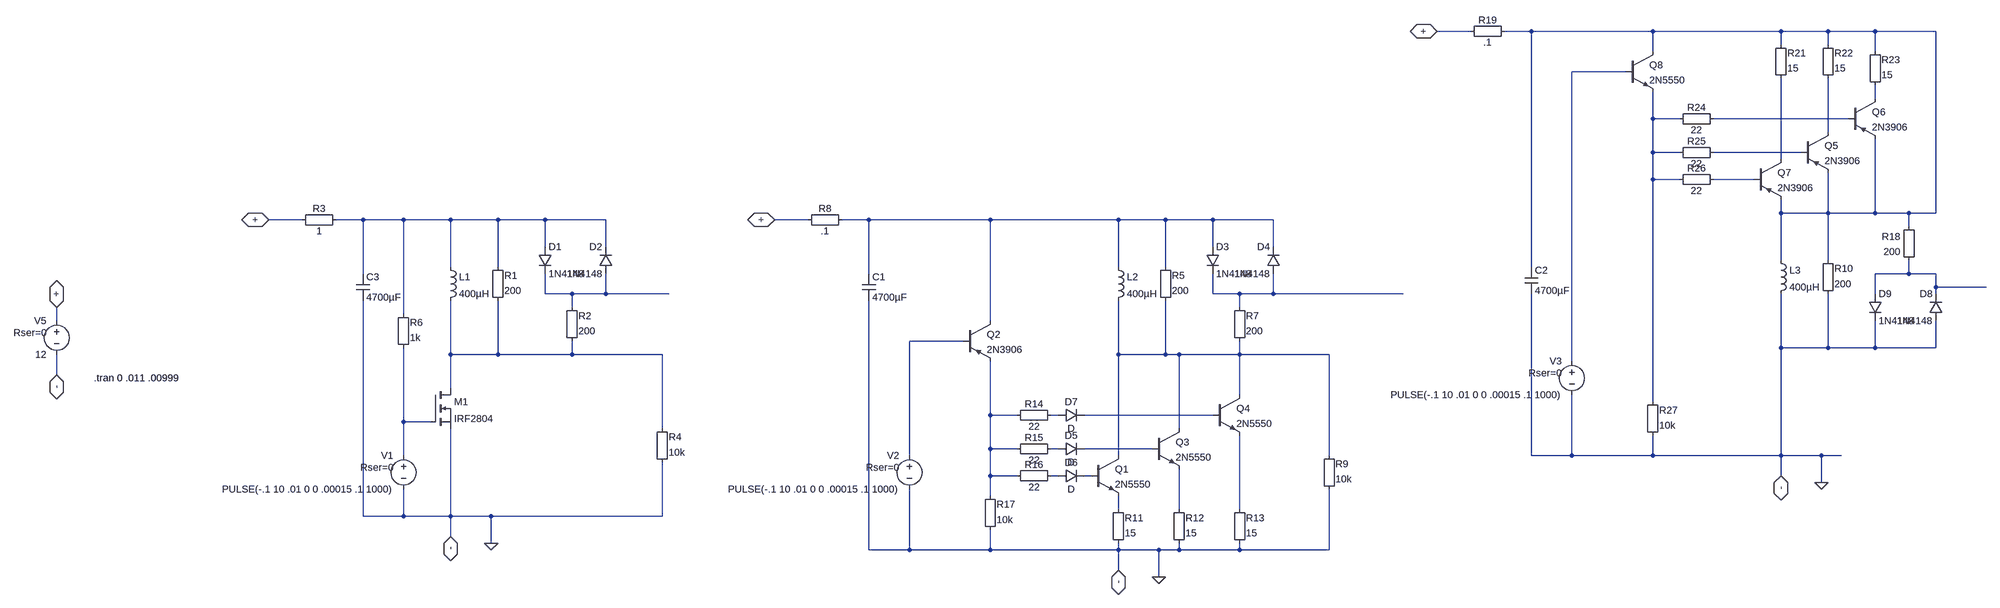
[diagram p0: schematic meat_haw_4.asc]
meat_haw_4.asc, the LTspice schematic file:
Version 4
SHEET 1 4676 1612
WIRE 2896 -2912 2816 -2912
WIRE 3040 -2912 2976 -2912
WIRE 3328 -2912 3040 -2912
WIRE 3632 -2912 3328 -2912
WIRE 3744 -2912 3632 -2912
WIRE 3856 -2912 3744 -2912
WIRE 4000 -2912 3856 -2912
WIRE 3632 -2880 3632 -2912
WIRE 3744 -2880 3744 -2912
WIRE 3328 -2864 3328 -2912
WIRE 3856 -2864 3856 -2912
WIRE 3264 -2816 3136 -2816
WIRE 3856 -2752 3856 -2784
WIRE 3328 -2704 3328 -2768
WIRE 3392 -2704 3328 -2704
WIRE 3792 -2704 3472 -2704
WIRE 3744 -2672 3744 -2800
WIRE 3328 -2624 3328 -2704
WIRE 3392 -2624 3328 -2624
WIRE 3680 -2624 3472 -2624
WIRE 3632 -2608 3632 -2800
WIRE 3328 -2560 3328 -2624
WIRE 3392 -2560 3328 -2560
WIRE 3568 -2560 3472 -2560
WIRE 3632 -2480 3632 -2512
WIRE 3744 -2480 3744 -2576
WIRE 3744 -2480 3632 -2480
WIRE 3856 -2480 3856 -2656
WIRE 3856 -2480 3744 -2480
WIRE 3936 -2480 3856 -2480
WIRE 4000 -2480 4000 -2912
WIRE 4000 -2480 3936 -2480
WIRE -112 -2464 -192 -2464
WIRE 32 -2464 -32 -2464
WIRE 128 -2464 32 -2464
WIRE 240 -2464 128 -2464
WIRE 352 -2464 240 -2464
WIRE 464 -2464 352 -2464
WIRE 608 -2464 464 -2464
WIRE 1312 -2464 1232 -2464
WIRE 1456 -2464 1392 -2464
WIRE 1744 -2464 1456 -2464
WIRE 2048 -2464 1744 -2464
WIRE 2160 -2464 2048 -2464
WIRE 2272 -2464 2160 -2464
WIRE 2416 -2464 2272 -2464
WIRE 3936 -2448 3936 -2480
WIRE 464 -2400 464 -2464
WIRE 608 -2400 608 -2464
WIRE 2272 -2400 2272 -2464
WIRE 2416 -2400 2416 -2464
WIRE 3632 -2368 3632 -2480
WIRE 3744 -2368 3744 -2480
WIRE 240 -2352 240 -2464
WIRE 352 -2352 352 -2464
WIRE 2048 -2352 2048 -2464
WIRE 2160 -2352 2160 -2464
WIRE 3040 -2352 3040 -2912
WIRE 32 -2336 32 -2464
WIRE 1456 -2336 1456 -2464
WIRE 3936 -2336 3936 -2368
WIRE 3936 -2336 3856 -2336
WIRE 4000 -2336 3936 -2336
WIRE 4000 -2304 4000 -2336
WIRE 4320 -2304 4000 -2304
WIRE 464 -2288 464 -2336
WIRE 528 -2288 464 -2288
WIRE 608 -2288 608 -2336
WIRE 608 -2288 528 -2288
WIRE 768 -2288 608 -2288
WIRE 2272 -2288 2272 -2336
WIRE 2336 -2288 2272 -2288
WIRE 2416 -2288 2416 -2336
WIRE 2416 -2288 2336 -2288
WIRE 2736 -2288 2416 -2288
WIRE 3856 -2288 3856 -2336
WIRE 4000 -2288 4000 -2304
WIRE 528 -2256 528 -2288
WIRE 2336 -2256 2336 -2288
WIRE 128 -2240 128 -2464
WIRE -720 -2224 -720 -2256
WIRE 1744 -2224 1744 -2464
WIRE 1680 -2176 1552 -2176
WIRE 3632 -2160 3632 -2288
WIRE 3744 -2160 3744 -2288
WIRE 3744 -2160 3632 -2160
WIRE 3856 -2160 3856 -2224
WIRE 3856 -2160 3744 -2160
WIRE 4000 -2160 4000 -2224
WIRE 4000 -2160 3856 -2160
WIRE 240 -2144 240 -2272
WIRE 352 -2144 352 -2272
WIRE 352 -2144 240 -2144
WIRE 528 -2144 528 -2176
WIRE 528 -2144 352 -2144
WIRE 752 -2144 528 -2144
WIRE 2048 -2144 2048 -2272
WIRE 2160 -2144 2160 -2272
WIRE 2160 -2144 2048 -2144
WIRE 2192 -2144 2160 -2144
WIRE 2336 -2144 2336 -2176
WIRE 2336 -2144 2192 -2144
WIRE 2560 -2144 2336 -2144
WIRE 3136 -2128 3136 -2816
WIRE -720 -2096 -720 -2144
WIRE 240 -2064 240 -2144
WIRE 2336 -2048 2336 -2144
WIRE 3328 -2032 3328 -2560
WIRE 1744 -2000 1744 -2128
WIRE 1808 -2000 1744 -2000
WIRE 1904 -2000 1888 -2000
WIRE 2272 -2000 1968 -2000
WIRE 128 -1984 128 -2160
WIRE 192 -1984 128 -1984
WIRE 752 -1968 752 -2144
WIRE 2192 -1968 2192 -2144
WIRE 1744 -1920 1744 -2000
WIRE 1808 -1920 1744 -1920
WIRE 1904 -1920 1888 -1920
WIRE 2128 -1920 1968 -1920
WIRE 128 -1904 128 -1984
WIRE 1552 -1904 1552 -2176
WIRE 2048 -1904 2048 -2144
WIRE 2560 -1904 2560 -2144
WIRE 3040 -1904 3040 -2288
WIRE 3136 -1904 3136 -2048
WIRE 3136 -1904 3040 -1904
WIRE 3328 -1904 3328 -1952
WIRE 3328 -1904 3136 -1904
WIRE 3632 -1904 3632 -2160
WIRE 3632 -1904 3328 -1904
WIRE 3728 -1904 3632 -1904
WIRE 3776 -1904 3728 -1904
WIRE 1744 -1856 1744 -1920
WIRE 1808 -1856 1744 -1856
WIRE 1904 -1856 1888 -1856
WIRE 1984 -1856 1968 -1856
WIRE 3632 -1856 3632 -1904
WIRE 3728 -1840 3728 -1904
WIRE 1744 -1808 1744 -1856
WIRE 2048 -1776 2048 -1808
WIRE 2192 -1776 2192 -1872
WIRE 2336 -1776 2336 -1952
WIRE 32 -1760 32 -2272
WIRE 128 -1760 128 -1824
WIRE 128 -1760 32 -1760
WIRE 240 -1760 240 -1968
WIRE 240 -1760 128 -1760
WIRE 336 -1760 240 -1760
WIRE 752 -1760 752 -1888
WIRE 752 -1760 336 -1760
WIRE 240 -1712 240 -1760
WIRE 336 -1696 336 -1760
WIRE 1456 -1680 1456 -2272
WIRE 1552 -1680 1552 -1824
WIRE 1552 -1680 1456 -1680
WIRE 1744 -1680 1744 -1728
WIRE 1744 -1680 1552 -1680
WIRE 2048 -1680 2048 -1696
WIRE 2048 -1680 1744 -1680
WIRE 2144 -1680 2048 -1680
WIRE 2192 -1680 2192 -1696
WIRE 2192 -1680 2144 -1680
WIRE 2336 -1680 2336 -1696
WIRE 2336 -1680 2192 -1680
WIRE 2560 -1680 2560 -1824
WIRE 2560 -1680 2336 -1680
WIRE 2048 -1632 2048 -1680
WIRE 2144 -1616 2144 -1680
FLAG -720 -2256 +
IOPIN -720 -2256 BiDir
FLAG -720 -2096 -
IOPIN -720 -2096 BiDir
FLAG 240 -1712 -
IOPIN 240 -1712 BiDir
FLAG -192 -2464 +
IOPIN -192 -2464 BiDir
FLAG 336 -1696 0
FLAG 2048 -1632 -
IOPIN 2048 -1632 BiDir
FLAG 1232 -2464 +
IOPIN 1232 -2464 BiDir
FLAG 2144 -1616 0
FLAG 3632 -1856 -
IOPIN 3632 -1856 BiDir
FLAG 2816 -2912 +
IOPIN 2816 -2912 BiDir
FLAG 3728 -1840 0
SYMBOL voltage -720 -2240 M0
WINDOW 123 0 0 Left 2
WINDOW 39 24 44 Left 2
SYMATTR SpiceLine Rser=0
SYMATTR InstName V5
SYMATTR Value 12
SYMBOL Misc\\EuropeanCap 16 -2336 R0
SYMATTR InstName C3
SYMATTR Value 4700µF
SYMATTR SpiceLine V=400 Irms=1 Rser=.32 Lser=0
SYMBOL ind 224 -2368 R0
SYMATTR InstName L1
SYMATTR Value 400µH
SYMBOL Misc\\EuropeanResistor 336 -2256 M180
WINDOW 0 31 76 Left 2
WINDOW 3 31 40 Left 2
SYMATTR InstName R1
SYMATTR Value 200
SYMBOL Misc\\EuropeanResistor 512 -2160 M180
WINDOW 0 31 76 Left 2
WINDOW 3 31 40 Left 2
SYMATTR InstName R2
SYMATTR Value 200
SYMBOL diode 448 -2400 R0
SYMATTR InstName D1
SYMATTR Value 1N4148
SYMBOL diode 624 -2336 R180
WINDOW 0 24 64 Left 2
WINDOW 3 24 0 Left 2
SYMATTR InstName D2
SYMATTR Value 1N4148
SYMBOL Misc\\EuropeanResistor -128 -2480 M90
WINDOW 0 5 56 VBottom 2
WINDOW 3 27 56 VTop 2
SYMATTR InstName R3
SYMATTR Value 1
SYMBOL nmos 192 -2064 R0
SYMATTR InstName M1
SYMATTR Value IRF2804
SYMBOL voltage 128 -1920 M0
WINDOW 123 0 0 Left 2
WINDOW 39 24 44 Left 2
SYMATTR SpiceLine Rser=0
SYMATTR InstName V1
SYMATTR Value PULSE(-.1 10 .01 0 0 .00015 .1 1000)
SYMBOL Misc\\EuropeanResistor 736 -1872 M180
WINDOW 0 31 76 Left 2
WINDOW 3 31 40 Left 2
SYMATTR InstName R4
SYMATTR Value 10k
SYMBOL Misc\\EuropeanResistor 112 -2144 M180
WINDOW 0 31 76 Left 2
WINDOW 3 31 40 Left 2
SYMATTR InstName R6
SYMATTR Value 1k
SYMBOL Misc\\EuropeanCap 1440 -2336 R0
SYMATTR InstName C1
SYMATTR Value 4700µF
SYMATTR SpiceLine V=400 Irms=1 Rser=.32 Lser=0
SYMBOL ind 2032 -2368 R0
SYMATTR InstName L2
SYMATTR Value 400µH
SYMATTR SpiceLine Rser=1
SYMBOL Misc\\EuropeanResistor 2144 -2256 M180
WINDOW 0 31 76 Left 2
WINDOW 3 31 40 Left 2
SYMATTR InstName R5
SYMATTR Value 200
SYMBOL Misc\\EuropeanResistor 2320 -2160 M180
WINDOW 0 31 76 Left 2
WINDOW 3 31 40 Left 2
SYMATTR InstName R7
SYMATTR Value 200
SYMBOL diode 2256 -2400 R0
SYMATTR InstName D3
SYMATTR Value 1N4148
SYMBOL diode 2432 -2336 R180
WINDOW 0 24 64 Left 2
WINDOW 3 24 0 Left 2
SYMATTR InstName D4
SYMATTR Value 1N4148
SYMBOL Misc\\EuropeanResistor 1296 -2480 M90
WINDOW 0 5 56 VBottom 2
WINDOW 3 27 56 VTop 2
SYMATTR InstName R8
SYMATTR Value .1
SYMBOL voltage 1552 -1920 M0
WINDOW 123 0 0 Left 2
WINDOW 39 24 44 Left 2
SYMATTR SpiceLine Rser=0
SYMATTR InstName V2
SYMATTR Value PULSE(-.1 10 .01 0 0 .00015 .1 1000)
SYMBOL Misc\\EuropeanResistor 2544 -1808 M180
WINDOW 0 31 76 Left 2
WINDOW 3 31 40 Left 2
SYMATTR InstName R9
SYMATTR Value 10k
SYMBOL npn3 1984 -1904 R0
SYMATTR InstName Q1
SYMATTR Value 2N5550
SYMBOL Misc\\EuropeanResistor 2032 -1680 M180
WINDOW 0 31 76 Left 2
WINDOW 3 31 40 Left 2
SYMATTR InstName R11
SYMATTR Value 15
SYMBOL pnp2 1680 -2224 R0
SYMATTR InstName Q2
SYMATTR Value 2N3906
SYMBOL npn3 2128 -1968 R0
SYMATTR InstName Q3
SYMATTR Value 2N5550
SYMBOL Misc\\EuropeanResistor 2176 -1680 M180
WINDOW 0 31 76 Left 2
WINDOW 3 31 40 Left 2
SYMATTR InstName R12
SYMATTR Value 15
SYMBOL npn3 2272 -2048 R0
SYMATTR InstName Q4
SYMATTR Value 2N5550
SYMBOL Misc\\EuropeanResistor 2320 -1680 M180
WINDOW 0 31 76 Left 2
WINDOW 3 31 40 Left 2
SYMATTR InstName R13
SYMATTR Value 15
SYMBOL Misc\\EuropeanResistor 1792 -2016 M90
WINDOW 0 5 56 VBottom 2
WINDOW 3 27 56 VTop 2
SYMATTR InstName R14
SYMATTR Value 22
SYMBOL Misc\\EuropeanResistor 1792 -1936 M90
WINDOW 0 5 56 VBottom 2
WINDOW 3 27 56 VTop 2
SYMATTR InstName R15
SYMATTR Value 22
SYMBOL Misc\\EuropeanResistor 1792 -1872 M90
WINDOW 0 5 56 VBottom 2
WINDOW 3 27 56 VTop 2
SYMATTR InstName R16
SYMATTR Value 22
SYMBOL Misc\\EuropeanResistor 1728 -1712 M180
WINDOW 0 31 76 Left 2
WINDOW 3 31 40 Left 2
SYMATTR InstName R17
SYMATTR Value 10k
SYMBOL diode 1904 -2016 M90
WINDOW 0 0 32 VBottom 2
WINDOW 3 32 32 VTop 2
SYMATTR InstName D7
SYMBOL diode 1904 -1936 M90
WINDOW 0 0 32 VBottom 2
WINDOW 3 32 32 VTop 2
SYMATTR InstName D5
SYMBOL diode 1904 -1872 M90
WINDOW 0 0 32 VBottom 2
WINDOW 3 32 32 VTop 2
SYMATTR InstName D6
SYMBOL Misc\\EuropeanCap 3024 -2352 R0
SYMATTR InstName C2
SYMATTR Value 4700µF
SYMATTR SpiceLine V=400 Irms=1 Rser=.32 Lser=0
SYMBOL ind 3616 -2384 R0
SYMATTR InstName L3
SYMATTR Value 400µH
SYMATTR SpiceLine Rser=1
SYMBOL Misc\\EuropeanResistor 3728 -2272 M180
WINDOW 0 31 76 Left 2
WINDOW 3 31 40 Left 2
SYMATTR InstName R10
SYMATTR Value 200
SYMBOL Misc\\EuropeanResistor 3952 -2464 M0
SYMATTR InstName R18
SYMATTR Value 200
SYMBOL diode 4016 -2224 R180
WINDOW 0 24 64 Left 2
WINDOW 3 24 0 Left 2
SYMATTR InstName D8
SYMATTR Value 1N4148
SYMBOL diode 3840 -2288 R0
SYMATTR InstName D9
SYMATTR Value 1N4148
SYMBOL Misc\\EuropeanResistor 2880 -2928 M90
WINDOW 0 5 56 VBottom 2
WINDOW 3 27 56 VTop 2
SYMATTR InstName R19
SYMATTR Value .1
SYMBOL voltage 3136 -2144 M0
WINDOW 123 0 0 Left 2
WINDOW 39 24 44 Left 2
SYMATTR SpiceLine Rser=0
SYMATTR InstName V3
SYMATTR Value PULSE(-.1 10 .01 0 0 .00015 .1 1000)
SYMBOL Misc\\EuropeanResistor 3616 -2784 M180
WINDOW 0 31 76 Left 2
WINDOW 3 31 40 Left 2
SYMATTR InstName R21
SYMATTR Value 15
SYMBOL pnp2 3792 -2752 R0
SYMATTR InstName Q6
SYMATTR Value 2N3906
SYMBOL Misc\\EuropeanResistor 3728 -2784 M180
WINDOW 0 31 76 Left 2
WINDOW 3 31 40 Left 2
SYMATTR InstName R22
SYMATTR Value 15
SYMBOL npn3 3264 -2864 R0
SYMATTR InstName Q8
SYMATTR Value 2N5550
SYMBOL Misc\\EuropeanResistor 3840 -2768 M180
WINDOW 0 31 76 Left 2
WINDOW 3 31 40 Left 2
SYMATTR InstName R23
SYMATTR Value 15
SYMBOL Misc\\EuropeanResistor 3376 -2720 M90
WINDOW 0 5 56 VBottom 2
WINDOW 3 27 56 VTop 2
SYMATTR InstName R24
SYMATTR Value 22
SYMBOL Misc\\EuropeanResistor 3376 -2640 M90
WINDOW 0 5 56 VBottom 2
WINDOW 3 27 56 VTop 2
SYMATTR InstName R25
SYMATTR Value 22
SYMBOL Misc\\EuropeanResistor 3376 -2576 M90
WINDOW 0 5 56 VBottom 2
WINDOW 3 27 56 VTop 2
SYMATTR InstName R26
SYMATTR Value 22
SYMBOL Misc\\EuropeanResistor 3312 -1936 M180
WINDOW 0 31 76 Left 2
WINDOW 3 31 40 Left 2
SYMATTR InstName R27
SYMATTR Value 10k
SYMBOL pnp2 3680 -2672 R0
SYMATTR InstName Q5
SYMATTR Value 2N3906
SYMBOL pnp2 3568 -2608 R0
SYMATTR InstName Q7
SYMATTR Value 2N3906
TEXT -632 -2088 Left 2 !.tran 0 .011 .00999

The netlist it stands for:
* meat_haw_4.asc
V5 + 0 12 Rser=0
C3 N010 0 4700µF V=400 Irms=1 Rser=.32 Lser=0
L1 N010 N016 400µH
R1 N016 N010 200
R2 N016 N013 200
D1 N010 N013 1N4148
D2 N013 N010 1N4148
R3 + N010 1
M1 N016 N021 0 0 IRF2804
V1 N021 0 PULSE(-.1 10 .01 0 0 .00015 .1 1000) Rser=0
R4 0 N016 10k
R6 N021 N010 1k
C1 N011 0 4700µF V=400 Irms=1 Rser=.32 Lser=0
L2 N011 N017 400µH Rser=1
R5 N017 N011 200
R7 N017 N014 200
D3 N011 N014 1N4148
D4 N014 N011 1N4148
R8 + N011 .1
V2 N015 0 PULSE(-.1 10 .01 0 0 .00015 .1 1000) Rser=0
R9 0 N017 10k
Q1 N017 N025 N026 0 2N5550
R11 0 N026 15
Q2 N011 N015 N018 0 2N3906
Q3 N017 N023 N027 0 2N5550
R12 0 N027 15
Q4 N017 N020 N028 0 2N5550
R13 0 N028 15
R14 N018 N019 22
R15 N018 N022 22
R16 N018 N024 22
R17 0 N018 10k
D7 N019 N020 D
D5 N022 N023 D
D6 N024 N025 D
C2 N001 0 4700µF V=400 Irms=1 Rser=.32 Lser=0
L3 N001 0 400µH Rser=1
R10 0 N001 200
R18 N001 N012 200
D8 0 N012 1N4148
D9 N012 0 1N4148
R19 + N001 .1
V3 N002 0 PULSE(-.1 10 .01 0 0 .00015 .1 1000) Rser=0
R21 N008 N001 15
Q6 N003 N005 N001 0 2N3906
R22 N006 N001 15
Q8 N001 N002 N004 0 2N5550
R23 N003 N001 15
R24 N004 N005 22
R25 N004 N007 22
R26 N004 N009 22
R27 0 N004 10k
Q5 N006 N007 N001 0 2N3906
Q7 N008 N009 N001 0 2N3906
.model D D
.lib standard.dio
.model NPN NPN
.model PNP PNP
.lib standard.bjt
.model NMOS NMOS
.model PMOS PMOS
.lib standard.mos
.tran 0 .011 .00999
.backanno
.end